# Altium schematic sheet PINS.SchDoc
size A4
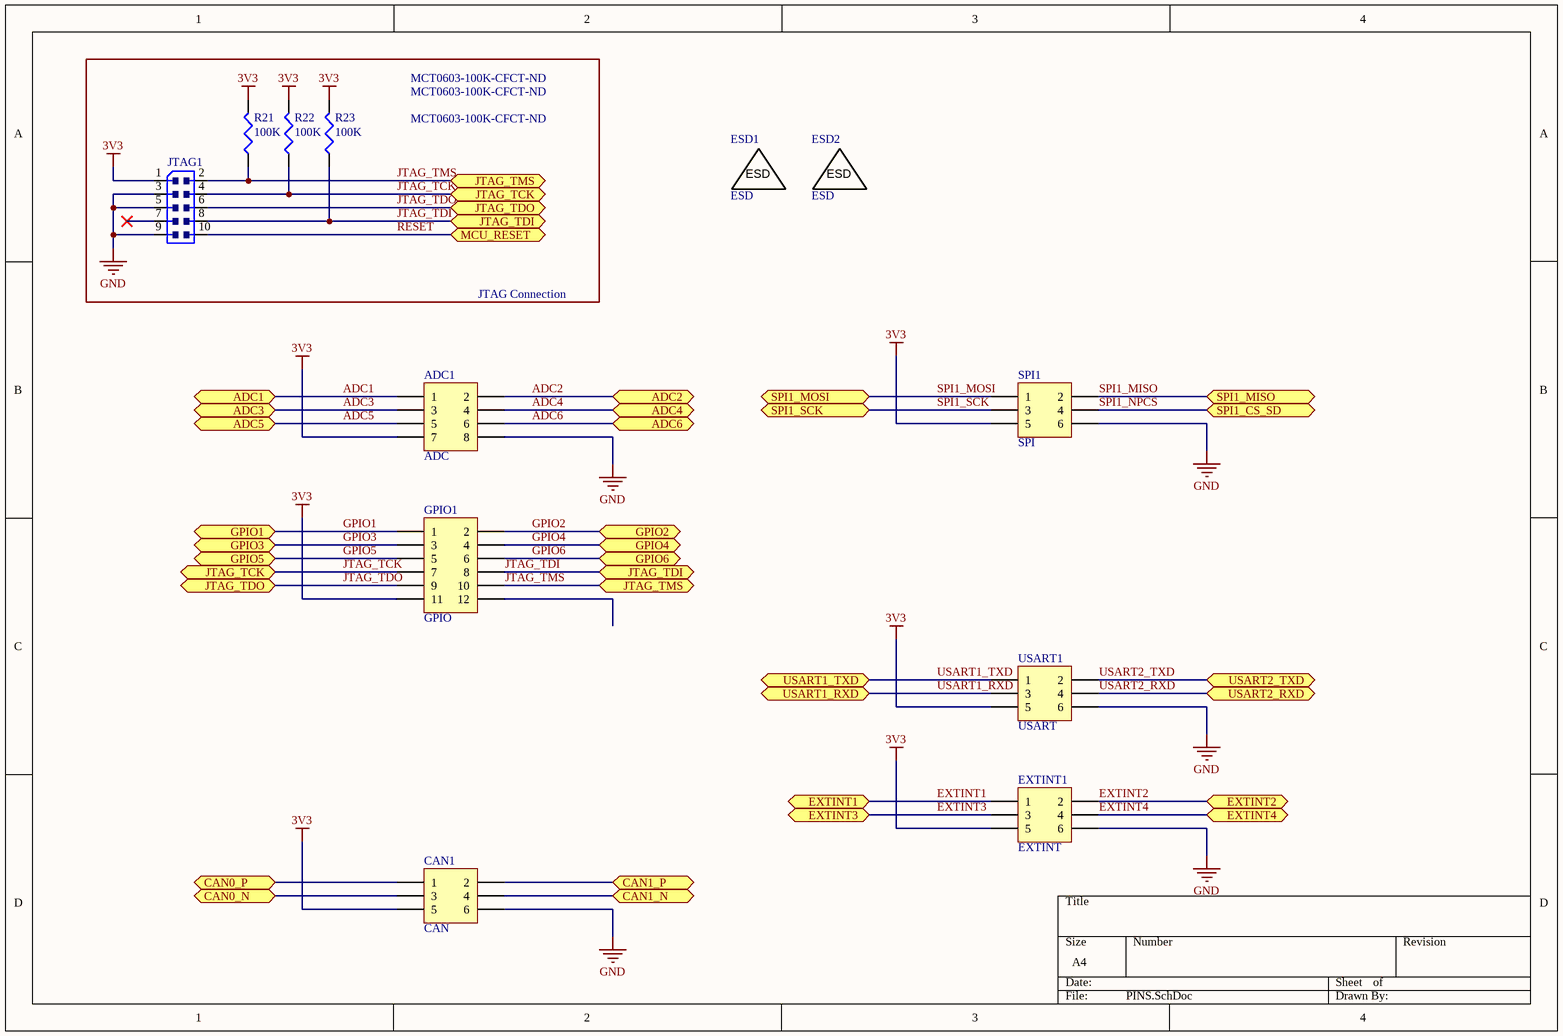
[diagram p0: PINS.SchDoc]

## Parts
ADC1  ADC  [HDR2X4]
CAN1  CAN  [HDR2X3]
ESD1  ESD  [ESDSILK]  (no BOM)
ESD2  ESD  [ESDSILK]  (no BOM)
EXTINT1  EXTINT  [HDR2X3]
GPIO1  GPIO  [HDR2X6]
JTAG1  *  [PINHEAD_2X05_127]  (value not drawn)
R21  value 100K  Supplier Part Number 1: MCT0603-100K-CFCT-ND  [0603R-GENERIC]  (hidden comment: Res3)
R22  value 100K  Supplier Part Number 1: MCT0603-100K-CFCT-ND  [0603R-GENERIC]  (hidden comment: Res3)
R23  value 100K  Supplier Part Number 1: MCT0603-100K-CFCT-ND  [0603R-GENERIC]  (hidden comment: Res3)
SPI1  SPI  [HDR2X3]
USART1  USART  [HDR2X3]

## Blocks framed on the sheet
JTAG Connection: JTAG1 R21-R23

## Ports
ADC1 (bidir), ADC2 (bidir), ADC3 (bidir), ADC4 (bidir), ADC5 (bidir), ADC6 (bidir), CAN0_N (bidir), CAN0_P (bidir), CAN1_N (bidir), CAN1_P (bidir), EXTINT1 (bidir), EXTINT2 (bidir), EXTINT3 (bidir), EXTINT4 (bidir), GPIO1 (bidir), GPIO2 (bidir), GPIO3 (bidir), GPIO4 (bidir), GPIO5 (bidir), GPIO6 (bidir), JTAG_TCK (bidir), JTAG_TDI (bidir), JTAG_TDO (bidir), JTAG_TMS (bidir), MCU_RESET (bidir), SPI1_CS_SD (bidir), SPI1_MISO (bidir), SPI1_MOSI (bidir), SPI1_SCK (bidir), USART1_RXD (bidir), USART1_TXD (bidir), USART2_RXD (bidir), USART2_TXD (bidir)

## Nets
3V3: ADC1.7 CAN1.5 EXTINT1.5 GPIO1.11 JTAG1.1 R21.2 R22.2 R23.2 SPI1.5 USART1.5
GND: ADC1.8 CAN1.6 EXTINT1.6 JTAG1.3 JTAG1.5 JTAG1.9 SPI1.6 USART1.6
ADC1: ADC1.1 ; port ADC1
ADC2: ADC1.2 ; port ADC2
ADC3: ADC1.3 ; port ADC3
ADC4: ADC1.4 ; port ADC4
ADC5: ADC1.5 ; port ADC5
ADC6: ADC1.6 ; port ADC6
CAN0_N: CAN1.3 ; port CAN0_N
CAN0_P: CAN1.1 ; port CAN0_P
CAN1_N: CAN1.4 ; port CAN1_N
CAN1_P: CAN1.2 ; port CAN1_P
EXTINT1: EXTINT1.1 ; port EXTINT1
EXTINT2: EXTINT1.2 ; port EXTINT2
EXTINT3: EXTINT1.3 ; port EXTINT3
EXTINT4: EXTINT1.4 ; port EXTINT4
GPIO1: GPIO1.1 ; port GPIO1
GPIO2: GPIO1.2 ; port GPIO2
GPIO3: GPIO1.3 ; port GPIO3
GPIO4: GPIO1.4 ; port GPIO4
GPIO5: GPIO1.5 ; port GPIO5
GPIO6: GPIO1.6 ; port GPIO6
JTAG_TCK: GPIO1.7 JTAG1.4 R22.1 ; port JTAG_TCK
JTAG_TDI: GPIO1.8 JTAG1.8 R23.1 ; port JTAG_TDI
JTAG_TDO: GPIO1.9 JTAG1.6 ; port JTAG_TDO
JTAG_TMS: GPIO1.10 JTAG1.2 R21.1 ; port JTAG_TMS
RESET: JTAG1.10 ; port MCU_RESET
SPI1_MISO: SPI1.2 ; port SPI1_MISO
SPI1_MOSI: SPI1.1 ; port SPI1_MOSI
SPI1_NPCS: SPI1.4 ; port SPI1_CS_SD
SPI1_SCK: SPI1.3 ; port SPI1_SCK
USART1_RXD: USART1.3 ; port USART1_RXD
USART1_TXD: USART1.1 ; port USART1_TXD
USART2_RXD: USART1.4 ; port USART2_RXD
USART2_TXD: USART1.2 ; port USART2_TXD

Not connected (* = marked no-connect by the designer): GPIO1 12; JTAG1 7*

## Library data of the parts
ADC1 = Header 4X2: Header, 4-Pin, Dual row; LatestRevisionDate: 17-Jul-2002; LatestRevisionNote: Re-released for DXP Platform.; Publisher: Altium Limited
CAN1 EXTINT1 SPI1 USART1 = Header 3X2: Header, 3-Pin, Dual row; LatestRevisionDate: 17-Jul-2002; LatestRevisionNote: Re-released for DXP Platform.; Publisher: Altium Limited
ESD1 ESD2 = ESD: ESD LOGO
GPIO1 = Header 6X2: Header, 6-Pin, Dual row; LatestRevisionDate: 17-Jul-2002; LatestRevisionNote: Re-released for DXP Platform.; Publisher: Altium Limited
JTAG1 = PINHEAD_PINHD-2X5PASSO127
R21-R23 = Res3: Resistor; Manufacturer: Vishay Beyschlag; Manufacturer Part Number: MCT06030C1003FP500; Tolerance: ±1%; Power (Watts): 0.125W, 1/8W; Temperature Coefficient: ±50ppm/°C; Published: 8-Jun-2000; LatestRevisionDate: 29-May-2009; LatestRevisionNote: IPC-7351 Footprint Added.; PackageReference: J1-0603; Publisher: Altium Limited; PackageDescription: Chip Resistor; Supplier 1: Digi-Key; RoHS: RoHS Compliant; Category: Resistors; Stock 1: 56018; Pricing 1: 1=0.1, 10=0.089, 50=0.0666, 100=0.0526, 500=0.04256, 1000=0.03095 (CAD); Packaging: Cut Tape (CT); Resistance (Ohms): 100k; Composition: Thin Film; Features: -; Operating Temperature: -55°C ~ 155°C; Package / Case: 0603 (1608 Metric); Supplier Device Package: 0603; Size / Dimension: 0.061" L x 0.033" W (1.55mm x 0.85mm); Height: 0.022" (0.55mm); Number of Terminations: 2; ComponentLink1URL: http://www.vishay.com/docs/28705/mc_pro.pdf; ComponentLink1Description: http://www.vishay.com/docs/28705/mc_pro.pdf